# Altium project LOKI-HBS-V1-r2.0.PrjPcb
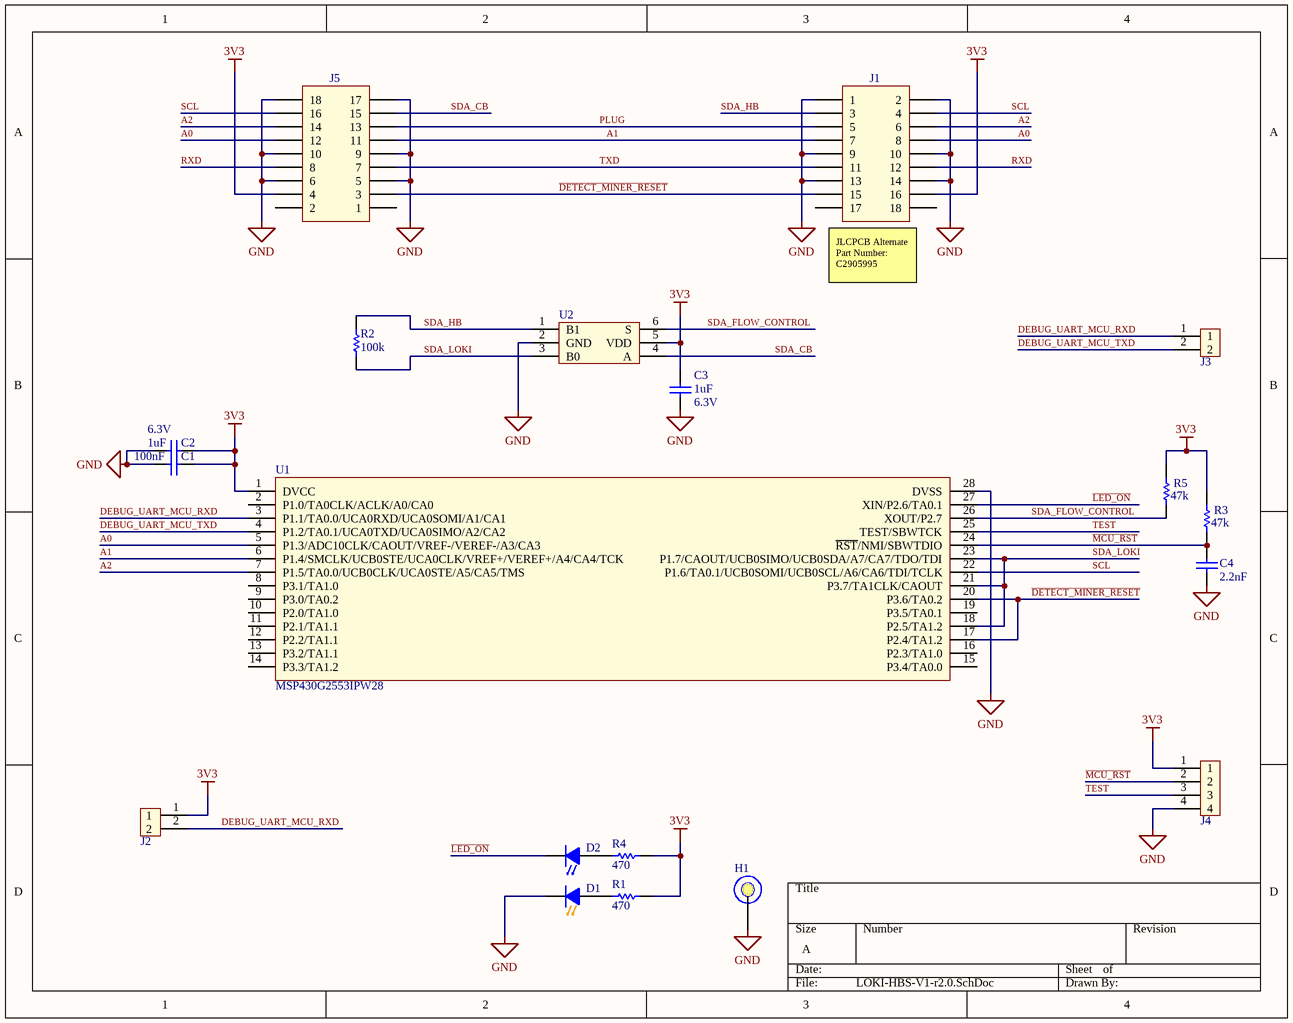
[diagram p0: LOKI-HBS-V1-r2.0.SchDoc]
1 sheet, 19 parts. Net scope: global (net labels, ports and power ports of the same name join across sheets).
Board file: LOKI-HBS-V1-r2.0.1.PcbDoc

## Sheet LOKI-HBS-V1-r2.0.SchDoc
size A; SheetNumber: 1; SheetTotal: 1

### Parts
C1  100nF  [C0402_L]
C2  1uF  Voltage - Rated: 6.3V  [C0402_L]
C3  1uF  Voltage - Rated: 6.3V  [C0402_L]
C4  2.2nF  [C0402_L]
D1  LED-ORANGE  [LED0603_L_ORANGE]  (value not drawn)
D2  LED-BLUE  [LED0603_L_BLUE]  (value not drawn)
H1  GenericConnectedMountingHole  [MountingHole(3mm hole, 4.5mm pad)]  (value not drawn)  (no BOM)
J1  HEADER_18POS_2x9  [BF050-18]  (value not drawn)
J2  Header_2POS  [2POS_RA_TH]  (value not drawn)
J3  Header_2POS  [H2_2.54mm_S_THOLE]  (value not drawn)  (no BOM)
J4  Header_4POS  [H4_2.54mm_S_THOLE]  (value not drawn)  (no BOM)
J5  HEADER_18POS_2x9  [2145-2X09]  (value not drawn)
R1  470  [R0402_L]
R2  100k  [R0402_L]
R3  47k  [R0402_L]
R4  470  [R0402_L]
R5  47k  [R0402_L]
U1  MSP430G2553IPW28  [28-TSSOP_L]
U2  PI5A3157CEX  [SC70-6]  (value not drawn)

### Nets
3V3: C1.2 C2.2 C3.2 J1.16 J2.1 J4.1 J5.4 R1.2 R3.2 R4.2 R5.2 U1.1(DVCC) U2.5(VDD)
GND: C1.1 C2.1 C3.1 C4.1 D1.2(K) H1.1 J1.1 J1.2 J1.9 J1.10 J1.13 J1.14 J4.4 J5.5 J5.6 J5.9 J5.10 J5.17 J5.18 U1.28(DVSS) U2.2(GND)
A0: J1.8 J5.12 U1.5(P1.3/ADC10CLK/CAOUT/VREF-/VEREF-/A3/CA3)
A1: J1.7 J5.11 U1.6(P1.4/SMCLK/UCB0STE/UCA0CLK/VREF+/VEREF+/A4/CA4/TCK)
A2: J1.6 J5.14 U1.7(P1.5/TA0.0/UCB0CLK/UCA0STE/A5/CA5/TMS)
~{DETECT_MINER_RESET}: J1.15 J5.3 U1.17(P2.4/TA1.2) U1.20(P3.6/TA0.2)
DEBUG_UART_MCU_RXD: J2.2 J3.1 U1.3(P1.1/TA0.0/UCA0RXD/UCA0SOMI/A1/CA1)
DEBUG_UART_MCU_TXD: J3.2 U1.4(P1.2/TA0.1/UCA0TXD/UCA0SIMO/A2/CA2)
~{LED_ON}: D2.2(K) U1.27(XIN/P2.6/TA0.1)
~{MCU_RST}: C4.2 J4.2 R3.1 U1.24(~{RST}/NMI/SBWTDIO)
PLUG: J1.5 J5.13
RXD: J1.12 J5.8
SCL: J1.4 J5.16 U1.22(P1.6/TA0.1/UCB0SOMI/UCB0SCL/A6/CA6/TDI/TCLK)
SDA_CB: J5.15 U2.4(A)
SDA_FLOW_CONTROL: R5.1 U1.26(XOUT/P2.7) U2.6(S)
SDA_HB: J1.3 R2.2 U2.1(B1)
SDA_LOKI: R2.1 U1.18(P2.5/TA1.2) U1.21(P3.7/TA1CLK/CAOUT) U1.23(P1.7/CAOUT/UCB0SIMO/UCB0SDA/A7/CA7/TDO/TDI) U2.3(B0)
TEST: J4.3 U1.25(TEST/SBWTCK)
TXD: J1.11 J5.7
NetD1_1: D1.1(A) R1.1
NetD2_1: D2.1(A) R4.1

Not connected (* = marked no-connect by the designer): J1 17 18; J5 1 2; U1 2(P1.0/TA0CLK/ACLK/A0/CA0) 8(P3.1/TA1.0) 9(P3.0/TA0.2) 10(P2.0/TA1.0) 11(P2.1/TA1.1) 12(P2.2/TA1.1) 13(P3.2/TA1.1) 14(P3.3/TA1.2) 15(P3.4/TA0.0) 16(P2.3/TA1.0) 19(P3.5/TA0.1)

### Notes on the sheet
- (near J1) JLCPCB Alternate Part Number: C2905995

### Library data of the parts
C1 = C1005X5R1A104K050BA (2): CAP CER 0.1UF 10V X5R 0402; Manufacturer: TDK Corporation; Tolerance: ±10%; Part Number: C1005X5R1A104K050BA (2); Supplier 1: Digi-Key; Supplier Part Number 1: 445-1265-2-ND; Manufacturer Part Number: C1005X5R1A104K050BA; RoHS: RoHS Compliant; Category: Capacitors; Capacitance: 100nF; Voltage - Rated: 10V; Temperature Coefficient: X5R
C2 C3 = JMK105BJ105KV-F: CAP CER 1UF 6.3V X5R 0402; Manufacturer: Taiyo Yuden; Tolerance: ±10%; Part Number: JMK105BJ105KV-F; Supplier 1: Digi-Key; Supplier Part Number 1: 587-1231-1-ND; Manufacturer Part Number: JMK105BJ105KV-F; RoHS: RoHS Compliant; Category: Capacitors; Stock 1: 0; Pricing 1: 1=0.1, 10=0.013, 100=0.0056, 500=0.004, 1000=0.00315, 2500=0.00286, 5000=0.00263 (USD); Capacitance: 1uF; Temperature Coefficient: X5R; Mounting Type: Surface Mount, MLCC; Operating Temperature: -55°C ~ 85°C; Applications: General Purpose; Ratings: -; Package / Case: 0402 (1005 Metric); Size / Dimension: 0.039" L x 0.020" W (1.00mm x 0.50mm); Lead Spacing: -; Features: -; Packaging: Cut Tape (CT); Lead Style: -; ComponentLink1URL: http://ds.yuden.co.jp/TYCOMPAS/ut/detail.do?productNo=JMK105BJ105KV-F&fileName=JMK105BJ105KV-F_SS&mode=specSheetDownload; ComponentLink1Description: http://ds.yuden.co.jp/TYCOMPAS/ut/detail.do?productNo=JMK105BJ105KV-F&fileName=JMK105BJ105KV-F_SS&mode=specSheetDownload; Height - Seated (Max): -; Thickness (Max): 0.022" (0.55mm); Part Status: Active
C4 = GRM155R71H222KA01D: CAP CER 2200PF 50V 10% X7R 0402; Manufacturer: Murata Electronics North America; Part Number: GRM155R71H222KA01D; Supplier 1: Digi-Key; Supplier Part Number 1: 490-1305-1-ND; Manufacturer Part Number: GRM155R71H222KA01D; RoHS: RoHS Compliant; Category: Capacitors; Stock 1: 571247; Pricing 1: 10=0.028, 50=0.0226, 100=0.017, 250=0.01228, 500=0.00908, 1000=0.00614 (USD); Capacitance: 2.2nF; Voltage - Rated: 50V; Tolerance: ±10%; Temperature Coefficient: X7R; Mounting Type: Surface Mount, MLCC; Operating Temperature: -55°C ~ 125°C; Applications: General Purpose; Ratings: -; Package / Case: 0402 (1005 Metric); Size / Dimension: 0.039" L x 0.020" W (1.00mm x 0.50mm); Height: -; Thickness: 0.022" (0.55mm); Lead Spacing: -; Features: -; Packaging: Cut Tape (CT); Lead Style: -; ComponentLink1URL: http://search.murata.co.jp/Ceramy/image/img/PDF/ENG/GRM155R71H222KA01.pdf; ComponentLink1Description: http://search.murata.co.jp/Ceramy/image/img/PDF/ENG/GRM155R71H222KA01.pdf
D1 = B1931UD--05D000314U1930: Led Orange Clear 1608 SMD; Manufacturer: Inolux; Part Number: B1931UD--05D000314U1930; Supplier 1: Digi-Key; Supplier Part Number 1: 3147-B1931UD--05D000314U1930CT-ND; Manufacturer Part Number: B1931UD--05D000314U1930; RoHS: No
D2 = LTST-C191TBKT: Single Color LED, Ultra Bright Blue, Water Clear, 1.1mm; Manufacturer: Vishay Lite-On; Viewing Angle: 130°; Forward Current: 20mA; Forward Voltage: 3.8V; Shape: Rectangular; Luminous Intensity-Nom: 104mcd; Channels: 1; Reverse Voltage-Max: 5V; Luminous Intensity-Min: 130cd; Overall Height: 0.55mm; Part Number: LTST-C191TBKT; ComponentLink1Description: https://datasheet.ciiva.com:443/pdfs/VipMasterIC/IC/LITE/LITE-S-A0009182577/LITE-S-A0009182577-1.pdf?src-supplier=IHS+Markit; ComponentLink1URL: https://datasheet.ciiva.com:443/pdfs/VipMasterIC/IC/LITE/LITE-S-A0009182577/LITE-S-A0009182577-1.pdf?src-supplier=IHS+Markit; ComponentLink2Description: https://datasheet.ciiva.com/2110/ltst-c191tbkt-2110256.pdf?src-supplier=Digi-Key; ComponentLink2URL: https://datasheet.ciiva.com/2110/ltst-c191tbkt-2110256.pdf?src-supplier=Digi-Key; Supplier 1: Arrow Electronics; Supplier Part Number 1: LTST-C191TBKT; Manufacturer Part Number: LTST-C191TBKT; RoHS: Yes; Category: LEDs; Stock 1: 3644; Pricing 1: 1=0.32580, 10=0.28310, 25=0.24740, 100=0.16540, 250=0.11260, 500=0.11150, 1000=0.08270, 3000=0.08190 (USD); Packaging: Tape and Reel; Color: Blue; ComponentLink3URL: https://datasheet.ciiva.com/19465/2047945-19465673.pdf?src-supplier=Jameco; ComponentLink3Description: https://datasheet.ciiva.com/19465/2047945-19465673.pdf?src-supplier=Jameco; Min Operating Temperature: -20°C; Max Operating Temperature: 80°C; ComponentLink4URL: https://datasheet.ciiva.com/11774/0900766b80dc02b4-11774413.pdf?src-supplier=RSComponents; ComponentLink4Description: https://datasheet.ciiva.com/11774/0900766b80dc02b4-11774413.pdf?src-supplier=RSComponents; RoHS Compliant: Yes; Pins: 2; Terminal Finish: Tin; JESD-609 Code: e3; Mounting Technology: Surface Mount; Color@wavelength: Blue; Optoelectronic Device Type: SINGLE COLOR LED; Lens Style: WATER CLEAR; Size: 1.1mm; Terminal Pitch: 1.5mm; Reach SVHC Compliant: Yes
H1 = MountingHole(3mm hole, 4.5mm pad): 3mm mounting hole with 4.5mm pad; Part Number: MountingHole(3mm hole, 4.5mm pad)
J1 = BF050-18-A-B-0400-0300-L-G: 18POS, 2MM Pitch Pin Hdr, Dil, T; Manufacturer: Global Connector Technology; Part Number: BF050-18-A-B-0400-0300-L-G; Supplier 1: Digi-Key; Supplier Part Number 1: 2073-BF050-18-A-B-0400-0300-L-G-ND; Manufacturer Part Number: BF050-18-A-B-0400-0300-L-G; RoHS: No; Stock 1: 2925; Pricing 1: 1=0.46, 10=0.388, 100=0.3019, 500=0.25876, 1000=0.21564, 5000=0.18483, 10000=0.17251 (USD); Category: Uncategorized
J2 = PH1RB-02-UA: Conn Unshrouded Header HDR 2 POS 2.54mm Solder RA Thru-Hole; Manufacturer: Adam Equipment; Part Number: PH1RB-02-UA; Supplier 1: Digi-Key; Supplier Part Number 1: 2057-PH1RB-02-UA-ND; Manufacturer Part Number: PH1RB-02-UA; RoHS: No; Stock 1: 23642; Pricing 1: 1=0.10000, 10=0.06500, 100=0.04830, 500=0.04000, 1000=0.03500, 5000=0.03000, 10000=0.02916 (USD); Category: Connectors
J3 = TSW-106-08-L-S-R: Conn Unshrouded Header HDR 2 POS 2.54mm Solder S Thru-Hole; Part Number: TSW-106-08-L-S-R
J4 = PRPC002SAAN-RC: Conn Header Vert 2POS 2.54MM; Manufacturer: Sullins; Connector Type: Male Pin; Number of Positions: 2; Pitch: 0.1inch; Part Number: PRPC002SAAN-RC; Supplier 1: Digi-Key; Supplier Part Number 1: S1011EC-02-ND; Manufacturer Part Number: PRPC002SAAN-RC; RoHS: Yes; Stock 1: 40901; Pricing 1: 1=0.08000, 10=0.07300, 25=0.05400, 50=0.04640, 100=0.04490, 250=0.03872, 500=0.03716 (USD); Package Quantity: 1; ComponentLink1URL: https://datasheet.ciiva.com/741/xrxczzzsxxn-rc-st-11635-b-741243.pdf?src-supplier=Digi-Key; ComponentLink1Description: https://datasheet.ciiva.com/741/xrxczzzsxxn-rc-st-11635-b-741243.pdf?src-supplier=Digi-Key; Category: Connectors; Number of Rows: 1; Contact Mating Length: 0.23inch; Termination: Solder; Color: Black; Packaging: Bulk; Contact Type: Male Pin; Contact Plating: Gold; Series: -; Mounting Technology: Through Hole
J5 = 2145-2X09: 18 Position Socket Connector 0.079" (2.00mm) Through Hole Gold; Manufacturer: Oupiin; Part Number: 2145-2X09; Manufacturer Part Number: 2145-2X09
R1 R4 = ERJ-2RKF4700X: RES 470 OHM 1/10W 1% 0402 SMD; Manufacturer: Panasonic - ECG; Temperature Coefficient: ±100ppm/°C; Power (Watts): 0.1W, 1/10W; Part Number: ERJ-2RKF4700X; Supplier 1: Digi-Key; Supplier Part Number 1: P470LCT-ND; Manufacturer Part Number: ERJ-2RKF4700X; RoHS: RoHS Compliant; Category: Resistors; Stock 1: 363974; Pricing 1: 1=0.06, 50=0.0242, 100=0.0184, 250=0.01364, 500=0.01008, 1000=0.00672, 5000=0.00473 (USD); Tolerance: ±1%; Package / Case: 0402 (1005 Metric); Size / Dimension: 0.039" L x 0.020" W (1.00mm x 0.50mm); Height: 0.016" (0.40mm); Features: -; Packaging: Cut Tape (CT); ComponentLink1URL: http://industrial.panasonic.com/www-cgi/jvcr13pz.cgi?E+PZ+3+AOA0002+ERJ2RKF4700X+7+WW; ComponentLink1Description: http://industrial.panasonic.com/www-cgi/jvcr13pz.cgi?E+PZ+3+AOA0002+ERJ2RKF4700X+7+WW; Resistance (Ohms): 470; Composition: Thick Film; Number of Terminations: 2
R2 = CRCW0402100KFKED: RES SMD 100K OHM 1% 1/16W 0402; Owlet Part Number: 12.0037.00; Manufacturer: Vishay Dale; Temperature Coefficient: ±100ppm/°C; Power (Watts): 0.063W, 1/16W; Resistance (Ohms): 100k; Part Number: CRCW0402100KFKED; Supplier 1: Digi-Key; Supplier Part Number 1: 541-100KLCT-ND; Manufacturer Part Number: CRCW0402100KFKED; RoHS: RoHS Compliant; Category: Resistors; Stock 1: 0; Pricing 1: 1=0.1, 10=0.037, 100=0.0149, 1000=0.0067, 2500=0.00582, 5000=0.00481 (USD); Tolerance: ±1%; Operating Temperature: -55°C ~ 155°C; Package / Case: 0402 (1005 Metric); Size / Dimension: 0.039" L x 0.020" W (1.00mm x 0.50mm); Features: Automotive AEC-Q200; Packaging: Cut Tape (CT); ComponentLink1URL: http://www.vishay.com/docs/20035/dcrcwe3.pdf; ComponentLink1Description: http://www.vishay.com/docs/20035/dcrcwe3.pdf; Composition: Thick Film; Supplier Device Package: 0402; Height - Seated (Max): 0.016" (0.40mm); Part Status: Active; Failure Rate: -
R3 R5 = ERJ-2GEJ473X: RES 47K OHM 1/10W 5% 0402 SMD; Manufacturer: Panasonic Electronic Components; Owlet Part Number: E0067; Power (Watts): 0.1W, 1/10W; Temperature Coefficient: ±200ppm/°C; Supplier 1: Digi-Key; Manufacturer Part Number: ERJ-2GEJ473X; RoHS: RoHS Compliant; Category: Resistors; Stock 1: 676841; Pricing 1: 1=0.1, 50=0.0172, 100=0.0131, 250=0.00976, 500=0.0072, 1000=0.0048, 5000=0.00338 (USD); Resistance (Ohms): 47k; Composition: Thick Film; Features: -; Tolerance: ±5%; Package / Case: 0402 (1005 Metric); Supplier Device Package: 0402; Size / Dimension: 0.039" L x 0.020" W (1.00mm x 0.50mm); Height: 0.016" (0.40mm); Number of Terminations: 2; Packaging: Cut Tape (CT); ComponentLink1URL: http://industrial.panasonic.com/www-cgi/jvcr13pz.cgi?E+PZ+3+AOA0001+ERJ2GEJ473X+7+WW; ComponentLink1Description: http://industrial.panasonic.com/www-cgi/jvcr13pz.cgi?E+PZ+3+AOA0001+ERJ2GEJ473X+7+WW; Supplier Part Number 1: P47KJCT-ND; Part Number: ERJ-2GEJ473X
U1 = MSP430G2553IPW28R: MSP430 MSP430G2xx Microcontroller IC 16-Bit 16MHz 16KB (16K x 8) FLASH 28-TSSOP; Manufacturer: Texas Instruments; Part Number: MSP430G2553IPW28R; Supplier 1: Arrow Electronics; Supplier Part Number 1: MSP430G2553IPW28R; Manufacturer Part Number: MSP430G2553IPW28R; RoHS: Yes; Category: Microcontrollers; Stock 1: 2000; Pricing 1: 1=3.54200, 10=3.10160, 25=2.97160, 100=2.55990, 250=2.41040, 500=2.19190, 1000=1.98950 (USD)
U2 = PI5A3157CEX: Analogue Sw, Spdt, -40 To 85Deg C Rohs Compliant: Yes; Manufacturer: Diodes; Part Number: PI5A3157CEX; Supplier 1: Newark; Supplier Part Number 1: 65AH9223; Manufacturer Part Number: PI5A3157CEX; RoHS: Yes; Category: Interface ICs; Stock 1: 1665; Pricing 1: 1=0.37000, 5=0.37000, 10=0.29900, 25=0.27300, 50=0.23800, 100=0.20300, 250=0.18400, 500=0.15200, 1000=0.11400 (USD)

## Assembly variants
Variant of LOKI-HBS-V1-r2.0.X.a: not fitted H1 J3 J4 J5